# EAGLE schematic power (EAGLE 9.3.2)
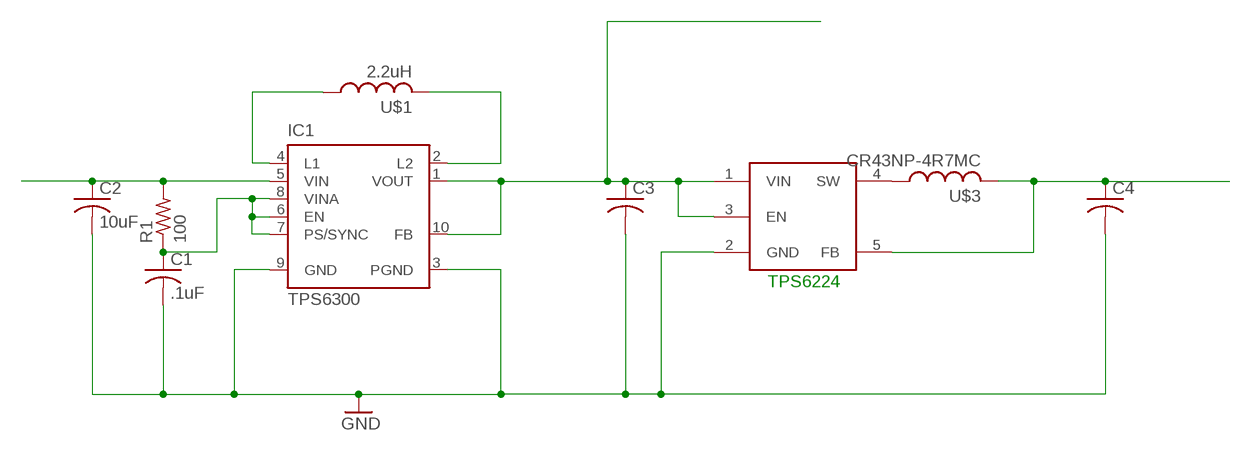
[diagram p0: schematic, sheet 1]

## Parts
C1  .1uF  C-USC0603  [C0603]
C2  10uF  C-USC0603  [C0603]
C3  C-USC0805  [C0805]
C4  C-USC1210  [C1210]
IC1  TPS6300  [DRC-S-PVSON-N10]
R1  100  R-US_01005  [R01005]
U$1  2.2uH  VLS4012  [INDUCTOR]
U$2  TPS62240  [TSP62240]
U$3  CR43NP-4R7MC  [INDUCTOR]

## Nets
GND: C1.2 C2.2 C3.2 C4.2 IC1.3(PGND) IC1.9(GND) U$2.2(GND)
N$1: C2.1 IC1.5(VIN) R1.2
N$2: C1.1 IC1.6(EN) IC1.7(PS/SYNC) IC1.8(VINA) R1.1
N$3: U$2.4(SW) U$3.P$1
N$4: C3.1 IC1.1(VOUT) IC1.10(FB) U$2.1(VIN) U$2.3(EN)
N$5: IC1.2(L2) U$1.P$2
N$6: IC1.4(L1) U$1.P$1
N$7: C4.1 U$2.5(FB) U$3.P$2
Unconnected: IC1.TH

## Notes on the sheet
- TPS6224

## Library data of the parts
C1-C4 = rcl:C-US: CAPACITOR, American symbol; SPICEPREFIX: C
IC1 = texas:TPS6300*: HIGH EFFICIENT SINGLE INDUCTOR BUCK-BOOST CONVERTER WITH 1.8-A SWITCHES Source: http://focus.ti.com/lit/ds/symlink/tps63001.pdf; MPN: TPS63000DRCTG4; OC_FARNELL: 1511852; OC_NEWARK: 59M7217
R1 = rcl:R-US_: RESISTOR, American symbol; SPICEPREFIX: R
U$1 = VLF4012:VLS4012
U$2 = TPS62240:TPS62240
U$3 = CR43NP-4R7MC:CR43NP-4R7MC